# EAGLE design Arduino_R3_Half (EAGLE 7.2.0)
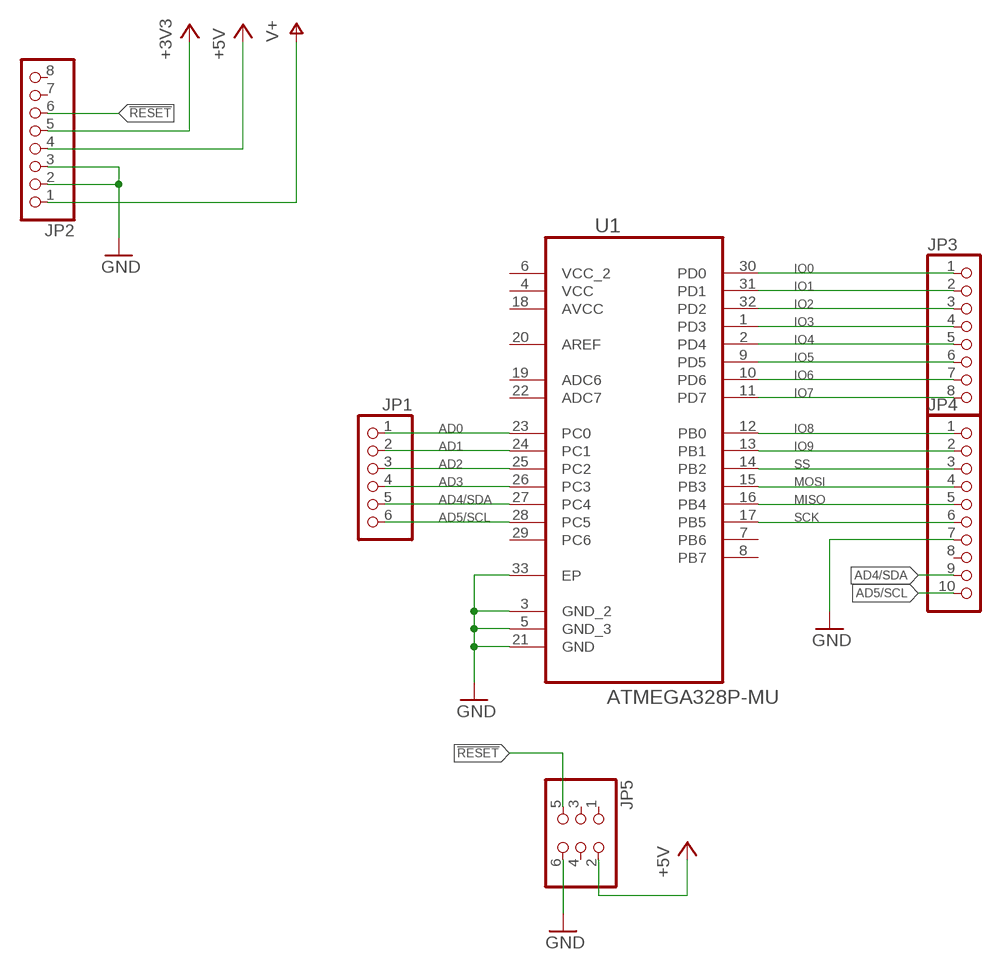
[diagram p0: schematic, sheet 1]

## Parts
JP1  PINHD-1X6  [1X06]
JP2  PINHD-1X8  [1X08]
JP3  PINHD-1X8  [1X08]
JP4  PINHD-1X10  [1X10]
JP5  PINHD-2X3  [2X03]
U1  ATMEGA328P-MU  [QFN50P500X500X100-33N]

## Nets
!RESET: JP2.6 JP5.5
+3V3: JP2.5
+5V [usbvcc]: JP2.4 JP5.2
AD0: JP1.1 U1.23(PC0)
AD1: JP1.2 U1.24(PC1)
AD2: JP1.3 U1.25(PC2)
AD3: JP1.4 U1.26(PC3)
AD4/SDA: JP1.5 JP4.9 U1.27(PC4)
AD5/SCL: JP1.6 JP4.10 U1.28(PC5)
GND [ground]: JP2.2 JP2.3 JP4.7 JP5.6 U1.3(GND_2) U1.5(GND_3) U1.21(GND) U1.33(EP)
IO0: JP3.1 U1.30(PD0)
IO1: JP3.2 U1.31(PD1)
IO2: JP3.3 U1.32(PD2)
IO3: JP3.4 U1.1(PD3)
IO4: JP3.5 U1.2(PD4)
IO5: JP3.6 U1.9(PD5)
IO6: JP3.7 U1.10(PD6)
IO7: JP3.8 U1.11(PD7)
IO8: JP4.1 U1.12(PB0)
IO9: JP4.2 U1.13(PB1)
MISO: JP4.5 U1.16(PB4)
MOSI: JP4.4 U1.15(PB3)
SCK: JP4.6 U1.17(PB5)
SS: JP4.3 U1.14(PB2)
V+ [power]: JP2.1
Unconnected: JP2.7 JP2.8 JP4.8 JP5.1 JP5.3 JP5.4 U1.7(PB6) U1.8(PB7) U1.19(ADC6) U1.20(AREF) U1.22(ADC7) U1.29(PC6)

## Power pins joined to a net without a drawn wire
AVCC: U1.18(AVCC)
VCC: U1.4(VCC)
VCC_2: U1.6(VCC_2)

## Library data of the parts
JP1 = Arduino_R3_Half_Template:PINHD-1X6: PIN HEADER
JP2 JP3 = Arduino_R3_Half_Template:PINHD-1X8: PIN HEADER
JP4 = Arduino_R3_Half_Template:PINHD-1X10: PIN HEADER
JP5 = Arduino_R3_Half_Template:PINHD-2X3: PIN HEADER
U1 = Arduino_R3_Half:ATMEGA328P-MU: Programmable Flash; MPN: ATMEGA328P-MU; OC_FARNELL: 1748522; OC_NEWARK: 26R2526; PACKAGE: QFN-32; SUPPLIER: Atmel

## Net classes
0 default: width 0.254 mm, clearance 0.254 mm
1 power: width 0.61 mm, drill 0.61 mm, clearance 0.254 mm
2 ground: width 0.305 mm, drill 0.559 mm, clearance 0.254 mm
3 usbvcc: width 0.508 mm, drill 0.61 mm, clearance 0.254 mm
4 aref: width 0.406 mm, drill 0.61 mm, clearance 0.254 mm

## Board
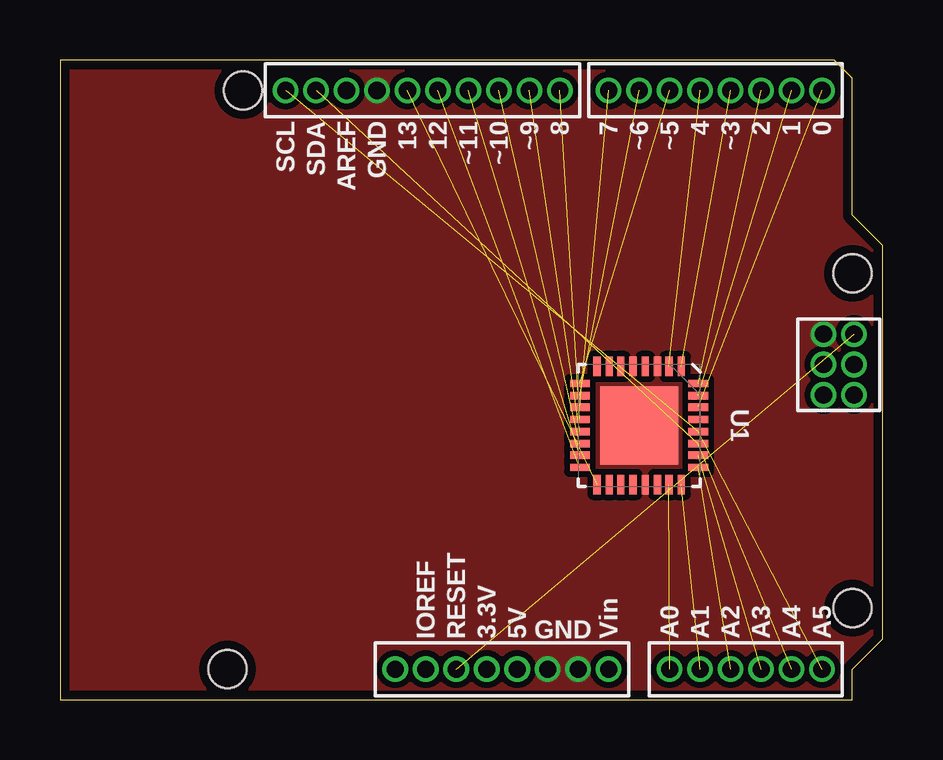
[diagram p1: board, top side]
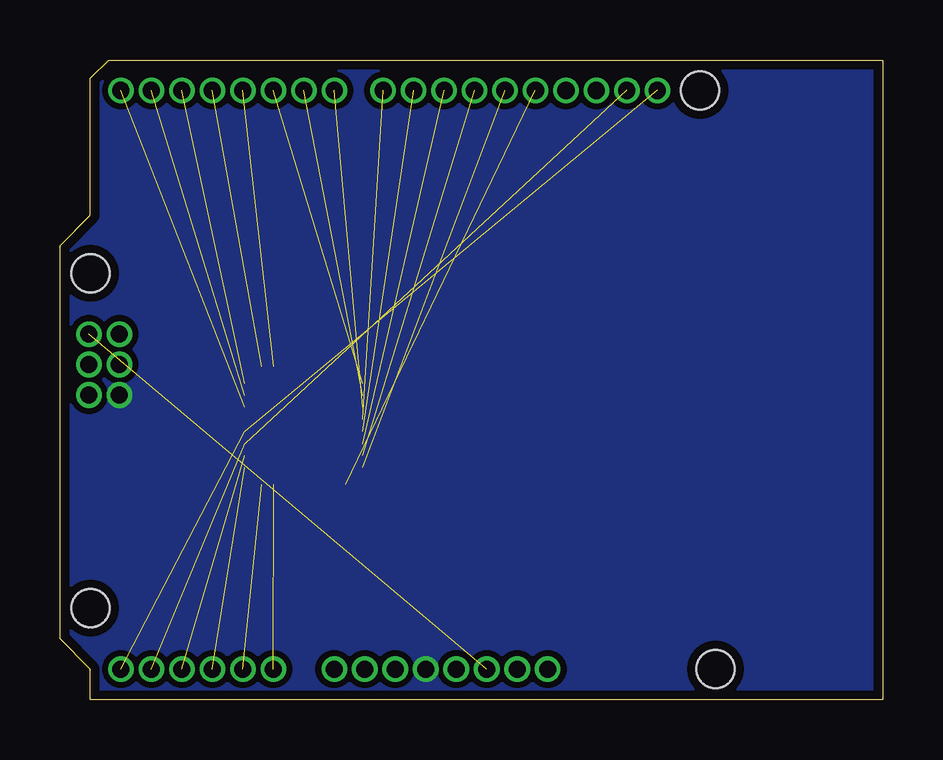
[diagram p2: board, bottom side, seen from below]

Size 34.29 x 26.67 mm. Coordinates in mm from the lower left corner, seen from the top.
Outline: 0,0 33.02,0 33.02,1.27 34.29,2.54 34.29,18.92 33.02,20.19 33.02,25.91 32.26,26.67 0,26.67 0,0
Copper layers (1*16): Top 0.0356mm / dielectric 1.5011mm / Bottom 0.0356mm
Design rules "oshpark-2layer": minimum track width 6mil, minimum drill 13mil, track to track 6mil, track to pad 6mil, pad to pad 6mil, via to via 6mil, smd to smd 6mil, copper to edge 15mil, drill to drill 6mil, minimum pad ring 7mil, minimum via ring 7mil, stop-mask expansion 4mil, vias tented up to drill 0mil, thermal gap 10mil
Holes 1.59 mm at 6.99,1.27 7.62,25.4 33.02,17.78 33.02,3.81

### Footprints (pad centres in the part's own frame; a part is rotated, then mirrored left to right if it is on the bottom)
1X06 = drill 0.711 pad 1.016: 1 -3.175,0; 2 -1.905,0; 3 -0.635,0; 4 0.635,0; 5 1.905,0; 6 3.175,0
1X08 = drill 0.711 pad 1.016: 1 -4.445,0; 2 -3.175,0; 3 -1.905,0; 4 -0.635,0; 5 0.635,0; 6 1.905,0; 7 3.175,0; 8 4.445,0
1X10 = drill 0.711 pad 1.016: 1 -5.715,0; 2 -4.445,0; 3 -3.175,0; 4 -1.905,0; 5 -0.635,0; 6 0.635,0; 7 1.905,0; 8 3.175,0; 9 4.445,0; 10 5.715,0
2X03 = drill 0.711 pad 1.016: 1 -1.27,-0.635; 2 -1.27,0.635; 3 0,-0.635; 4 0,0.635; 5 1.27,-0.635; 6 1.27,0.635
QFN50P500X500X100-33N = smd 0.813 x 0.305: 1 -2.464,1.753; 2 -2.464,1.245; 3 -2.464,0.762; 4 -2.464,0.254; 5 -2.464,-0.254; 6 -2.464,-0.762; 7 -2.464,-1.245; 8 -2.464,-1.753; 17 2.464,-1.753; 18 2.464,-1.245; 19 2.464,-0.762; 20 2.464,-0.254; 21 2.464,0.254; 22 2.464,0.762; 23 2.464,1.245; 24 2.464,1.753 | smd 0.305 x 0.813: 9 -1.753,-2.464; 10 -1.245,-2.464; 11 -0.762,-2.464; 12 -0.254,-2.464; 13 0.254,-2.464; 14 0.762,-2.464; 15 1.245,-2.464; 16 1.753,-2.464; 25 1.753,2.464; 26 1.245,2.464; 27 0.762,2.464; 28 0.254,2.464; 29 -0.254,2.464; 30 -0.762,2.464; 31 -1.245,2.464; 32 -1.753,2.464 | smd 3.251 x 3.251: 33 0,0

### Placement (x,y rotation side)
JP1  28.57,1.27 0 top
JP2  18.41,1.27 180 top
JP3  27.3,25.4 180 top
JP4  15.11,25.4 180 top
JP5  32.45,13.97 90 top
U1  24.13,11.43 270 top

### Tracks (layer width: path | path; a pad name or v marks a point on that pad's centre or on a via)
!RESET  (1 unrouted)
+5V
  pour Bottom (no thermals): 0,0 33.02,0 33.02,1.27 34.29,2.54 34.29,18.92 33.02,20.19 33.02,25.91 32.26,26.67 0,26.67
AD0  (1 unrouted)
AD1  (1 unrouted)
AD2  (1 unrouted)
AD3  (1 unrouted)
AD4/SDA  (2 unrouted)
AD5/SCL  (2 unrouted)
GND
  pour Top (no thermals): 0,0 33.02,0 33.02,1.27 34.29,2.54 34.29,18.92 33.02,20.19 33.02,25.91 32.26,26.67 0,26.67
IO0  (1 unrouted)
IO1  (1 unrouted)
IO2  (1 unrouted)
IO3  (1 unrouted)
IO4  (1 unrouted)
IO5  (1 unrouted)
IO6  (1 unrouted)
IO7  (1 unrouted)
IO8  (1 unrouted)
IO9  (1 unrouted)
MISO  (1 unrouted)
MOSI  (1 unrouted)
SCK  (1 unrouted)
SS  (1 unrouted)

### Text on the board
tPlace: SCL | SDA | AREF | GND | 13 | 12 | ~11 | ~10 | ~9 | 8 | 7 | ~6 | ~5 | 4 | ~3 | 2 | 1 | 0 | IOREF | RESET | 3.3V | 5V | GND | Vin | A0 | A1 | A2 | A3 | A4 | A5